# Altium schematic sheet OMODRI_Hardware.SchDoc
size A3; Date: Not shown in title block; ApprovedBy: Not shown in title block; CheckedBy: Not shown in title block; Author: Not shown in title block; CompanyName: Not shown in title block; Engineer: Not shown in title block; Organization: Not shown in title block; Address1: Not shown in title block; Address2: Not shown in title block; Address3: Not shown in title block; Address4: Not shown in title block; DocumentNumber: 1; Revision: Use project parameter SCH_Rev; SheetNumber: 3; SheetTotal: 3; PageSetup: Record=PageOptions|CenterHorizontal=True|CenterVertical=True|PrintScale=1.00|XCorrection=1.00|YCorrection=1.00|PrintKind=0|BorderSize=5000000|LeftOffset=0|BottomOffset=0|Orientation=2|PaperLength=1000|PaperWidth=1000|Scale=100|PaperSource=15|PrintQuality=600|MediaType=1|DitherType=10|PaperKind=Letter|PrintScaleMode=1; CurrentTime: Not shown in title block; CurrentDate: Not shown in title block; Time: Not shown in title block; DocumentFullPathAndName: Not shown in title block; DocumentName: Not shown in title block; ModifiedDate: Not shown in title block; ImagePath: Not shown in title block
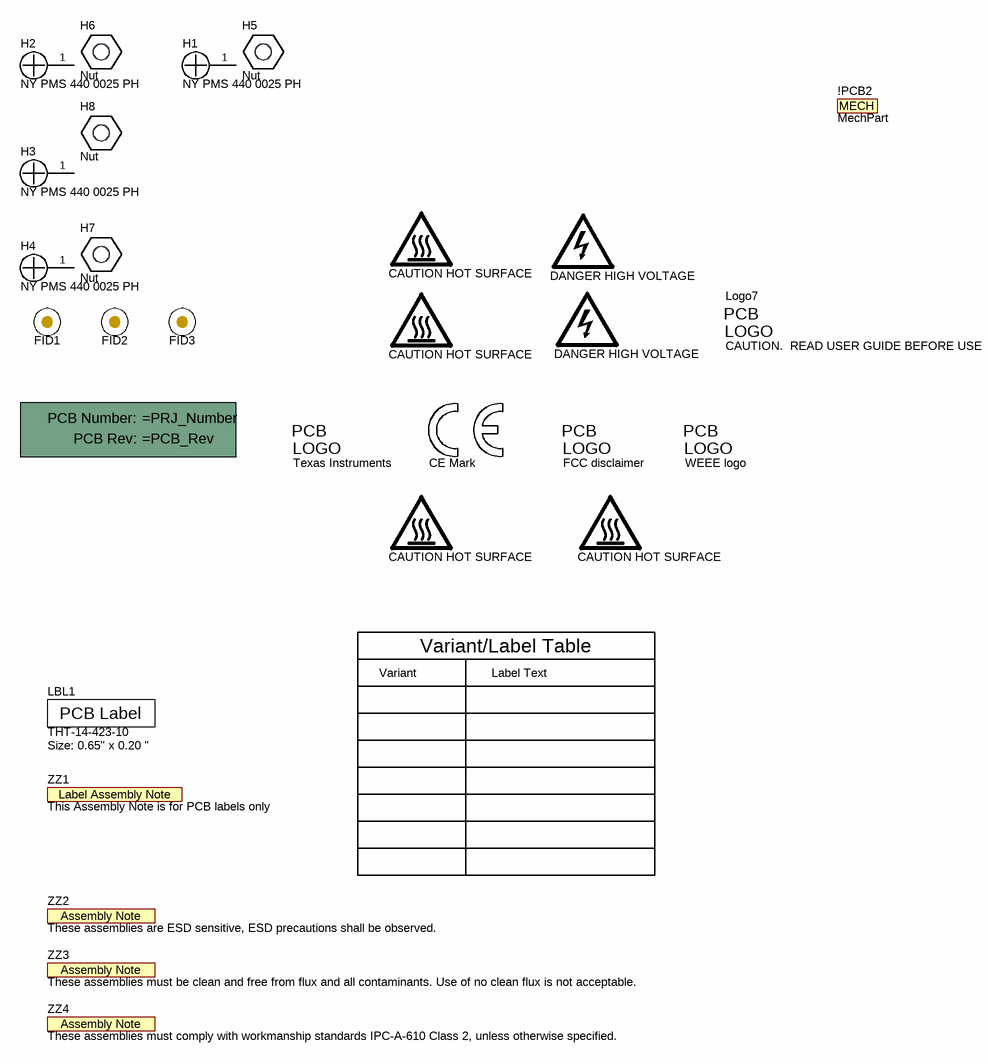
[diagram p0: OMODRI_Hardware.SchDoc]

## Parts
!PCB1  Printed Circuit Board  (value not drawn)  (mechanical)
!PCB2  MechPart  (mechanical)
FID1  Fiducial  [Fiducial10-20]  (value not drawn)
FID2  Fiducial  [Fiducial10-20]  (value not drawn)
FID3  Fiducial  [Fiducial10-20]  (value not drawn)
H1  NY PMS 440 0025 PH  [NY PMS 440 0025 PH]
H2  NY PMS 440 0025 PH  [NY PMS 440 0025 PH]
H3  NY PMS 440 0025 PH  [NY PMS 440 0025 PH]
H4  NY PMS 440 0025 PH  [NY PMS 440 0025 PH]
H5  Nut  [Keystone_1902C]
H6  Nut  [Keystone_1902C]
H7  Nut  [Keystone_1902C]
H8  Nut  [Keystone_1902C]
LBL1  THT-14-423-10  Note: Size: 0.65" x 0.20 "  [Label_650x200]
LOGO1  CAUTION HOT SURFACE  [IEC_HotSurface_Small]  (no BOM)
LOGO2  DANGER HIGH VOLTAGE  [IEC_HighVoltage_Small]  (no BOM)
LOGO3  DANGER HIGH VOLTAGE  [IEC_HighVoltage_Small]  (no BOM)
LOGO4  CAUTION HOT SURFACE  [IEC_HotSurface_Small]  (no BOM)
LOGO5  WEEE logo  [WEEE_Minimum]  (no BOM)
Logo6  Texas Instruments  [TI_Stacked_Overlay_Small]  (no BOM)
Logo7  CAUTION.  READ USER GUIDE BEFORE USE  [IEC_Caution_Small]  (no BOM)
Logo8  CE Mark  [CE_Mark_5mm]  (no BOM)
Logo9  FCC disclaimer  [FCC_disclaimer]  (no BOM)
LOGO10  CAUTION HOT SURFACE  [IEC_HotSurface_Small]  (no BOM)
LOGO11  CAUTION HOT SURFACE  [IEC_HotSurface_Small]  (no BOM)
ZZ1  This Assembly Note is for PCB labels only  [AssemblyNoteLabel]  (no BOM)
ZZ2  These assemblies are ESD sensitive, ESD precautions shall be observed.  [AssemblyNote]  (no BOM)
ZZ3  These assemblies must be clean and free from flux and all contaminants. Use of no clean flux is not acceptable.  [AssemblyNote]  (no BOM)
ZZ4  These assemblies must comply with workmanship standards IPC-A-610 Class 2, unless otherwise specified.  [AssemblyNote]  (no BOM)

## Nets

Not connected (* = marked no-connect by the designer): H1 1; H2 1; H3 1; H4 1

## Notes on the sheet
- Variant
- Variant/Label Table
- Label Text
- Drawn By:
- SVN Rev:
- Number:
- TID #:
- Orderable:
- Rev:
- Sheet Title:
- File:
- Project Title:
- Designed for:
- Assembly Variant:
- Mod. Date:
- Sheet:
- Size:
- of
- B
- http://www.ti.com
- Texas Instruments and/or its licensors do not warrant the accuracy or completeness of this specification or any information contained therein. Texas Instruments and/or its licensors do not warrant that this design will meet the specifications, will be suitable for your application or fit for any particular purpose, or will operate in an implementation. Texas Instruments and/or its licensors do not warrant that the design is production worthy. You should completely validate and test your design implementation to confirm the system functionality for your application.
- Engineer:
- Contact:
- © Texas Instruments
- (in symbol CMP-0003616-3) Label Assembly Note
- (in symbol CMP-0003618-2) PCB Number:; PCB Rev:
- (in symbol CMP-0003625-1) PCB Label
- (in symbol CMP-0074769-1) PCB; LOGO
- (in symbol CMP-0074836-1) PCB; LOGO
- (in symbol CMP-0074838-1) PCB; LOGO
- (in symbol CMP-0074847-1) PCB; LOGO
- (in symbol CMP-0080604-2) MECH

## Library data of the parts
!PCB1 = CMP-0003618-2: Manufacturer: Any; CompType: PCB; PartNumber: =PRJ_Number; RoHS: O; MountType: N/A; Publisher: Texas Instruments; LatestRevisionDate: 2017-03-09; Key: PCB
!PCB2 = CMP-0080604-2: Partner board for MD016  Kitting item; Manufacturer: Any; PartNumber: MD017; CompType: Mechanical; ComponentLink1URL: Paste URL for datasheet here; RoHS: Used in BOM report; ComponentLink1Description: Datasheet Link; Discription: Partner board for MD016  Kitting item
FID1-FID3 = CMP-0077181-1: Fiducial mark.  There is nothing to buy or mount.; CompType: Fiducial; Manufacturer: N/A; MountType: N/A; PackageReference: N/A; PartNumber: N/A; ClassName: FiducialMark; Library Reference: Fiducial
H1-H4 = CMP-0003617-1: Machine Screw, Round, #4-40 x 1/4, Nylon, Philips panhead; Manufacturer: B&F Fastener Supply; CompType: Hardware; MountType: N/A; RoHS: Y; PartNumber: NY PMS 440 0025 PH; PackageReference: Screw; ComponentLink1Description: Datasheet Link; ComponentLink1URL: http://www.fasnetdirect.com/refguide/Nylpanms.pdf; ClassName: Mounting Holes; LatestRevisionDate: 2017-03-09; Publisher: Texas Instruments; Supplier 1: Digi-Key; Supplier Part Number 1: H542-ND; Key: NY PMS 440 0025 PH
H5-H8 = CMP-0003610-1: Standoff, Hex, 0.5"L #4-40 Nylon; Manufacturer: Keystone; PartNumber: 1902C; CompType: Hardware; MountType: N/A; RoHS: Y; PackageReference: Standoff; ComponentLink1Description: Datasheet Link; ComponentLink1URL: http://www.keyelco.com/pdfs/M55-prod31.pdf; LatestRevisionDate: 2017-03-09; Publisher: Texas Instruments; Supplier 1: Digi-Key; Supplier Part Number 1: 36-1902C-ND; Key: 1902C
LBL1 = CMP-0003625-1: Thermal Transfer Printable Labels, 0.650" W x 0.200" H - 10,000 per roll; Manufacturer: Brady; CompType: Label; ClassName: Label; PartNumber: THT-14-423-10; RoHS: Y; PackageReference: PCB Label 0.650 x 0.200 inch; MountType: N/A; ComponentLink1Description: Web Page; ComponentLink1URL: http://www.bradyid.com/bradyid/pdpv/THT-14-423-10.html; Publisher: Texas Instruments; LatestRevisionDate: 2017-03-09; Supplier 1: Newark; Supplier Part Number 1: 97C5133; Supplier 2: Farnell; Supplier Part Number 2: 2065596; Key: THT-14-423-10
LOGO1 LOGO4 LOGO10 LOGO11 = CMP-0074837-1: IEC 61010-1 Hot Surface Warning; SymbolCreator: a0412235; Lib Reference: IEC_HotSurface; SymbolVersion: 2011-08-22; Published: 2009-03-03; Publisher: Texas Instruments; LatestRevisionDate: 2017-07-06; PartNumber: CAUTION HOT SURFACE; Library Reference: IEC_HotSurface
LOGO2 LOGO3 = CMP-0074835-1: IEC 61010-1 High Voltage Warning; SymbolCreator: a0412235; Lib Reference: IEC_HighVoltage; SymbolVersion: 2011-08-22; Published: 2009-03-03; Publisher: Texas Instruments; LatestRevisionDate: 2017-07-06; PartNumber: DANGER HIGH VOLTAGE; Library Reference: IEC_HighVoltage
LOGO5 = CMP-0074769-1: Library Reference: WEEE logo; Lib Reference: WEEE logo; PartNumber: WEEE logo
Logo6 = CMP-0074838-1: Texas Instrument Corporate Signature; SymbolCreator: a0412235; Lib Reference: TI_Logo; Library Reference: Logo; SymbolVersion: 2011-08-22; Published: 2009-03-03; Publisher: Texas Instruments; ClassName: Logo; LatestRevisionDate: 2017-07-06; PartNumber: Texas Instruments
Logo7 = CMP-0074836-1: IEC 61010-1 Caution Warning; Library Reference: Logo; SymbolCreator: a0412235; Lib Reference: IEC_Caution; Publisher: Texas Instruments; SymbolVersion: 2011-08-22; Published: 2009-03-03; LatestRevisionDate: 2017-07-06; PartNumber: CAUTION.  READ USER GUIDE BEFORE USE
Logo8 = CMP-0074844-1: SymbolCreator: a0412235; Published: 2009-03-03; Publisher: Texas Instruments; LatestRevisionDate: 2017-07-06; Lib Reference: CE Mark; PartNumber: CE Mark; Library Reference: CE Mark
Logo9 = CMP-0074847-1: FCC_disclaimer; Library Reference: Logo; Published: 2009-03-03; Publisher: Texas Instruments; LatestRevisionDate: 2017-07-06; Lib Reference: FCC_disclaimer; PartNumber: FCC disclaimer
ZZ1 = CMP-0003616-3: CompType: AssemblyNote; ClassName: AssemblyNote; Publisher: Texas Instruments; LatestRevisionDate: 2017-03-09; Key: AssemblyNoteLabel
ZZ2 = CMP-0077236-1: CompType: AssemblyNote; ClassName: AssemblyNote; Publisher: Texas Instruments; LatestRevisionDate: 2017-08-10; Key: AssemblyNote
ZZ3 = CMP-0077237-1: CompType: AssemblyNote; ClassName: AssemblyNote; Publisher: Texas Instruments; LatestRevisionDate: 2017-08-10; Key: AssemblyNote
ZZ4 = CMP-0077238-1: CompType: AssemblyNote; ClassName: AssemblyNote; Publisher: Texas Instruments; LatestRevisionDate: 2017-08-10; Key: AssemblyNote